# EAGLE design BusBlaster-v3.5 (EAGLE 5.07)
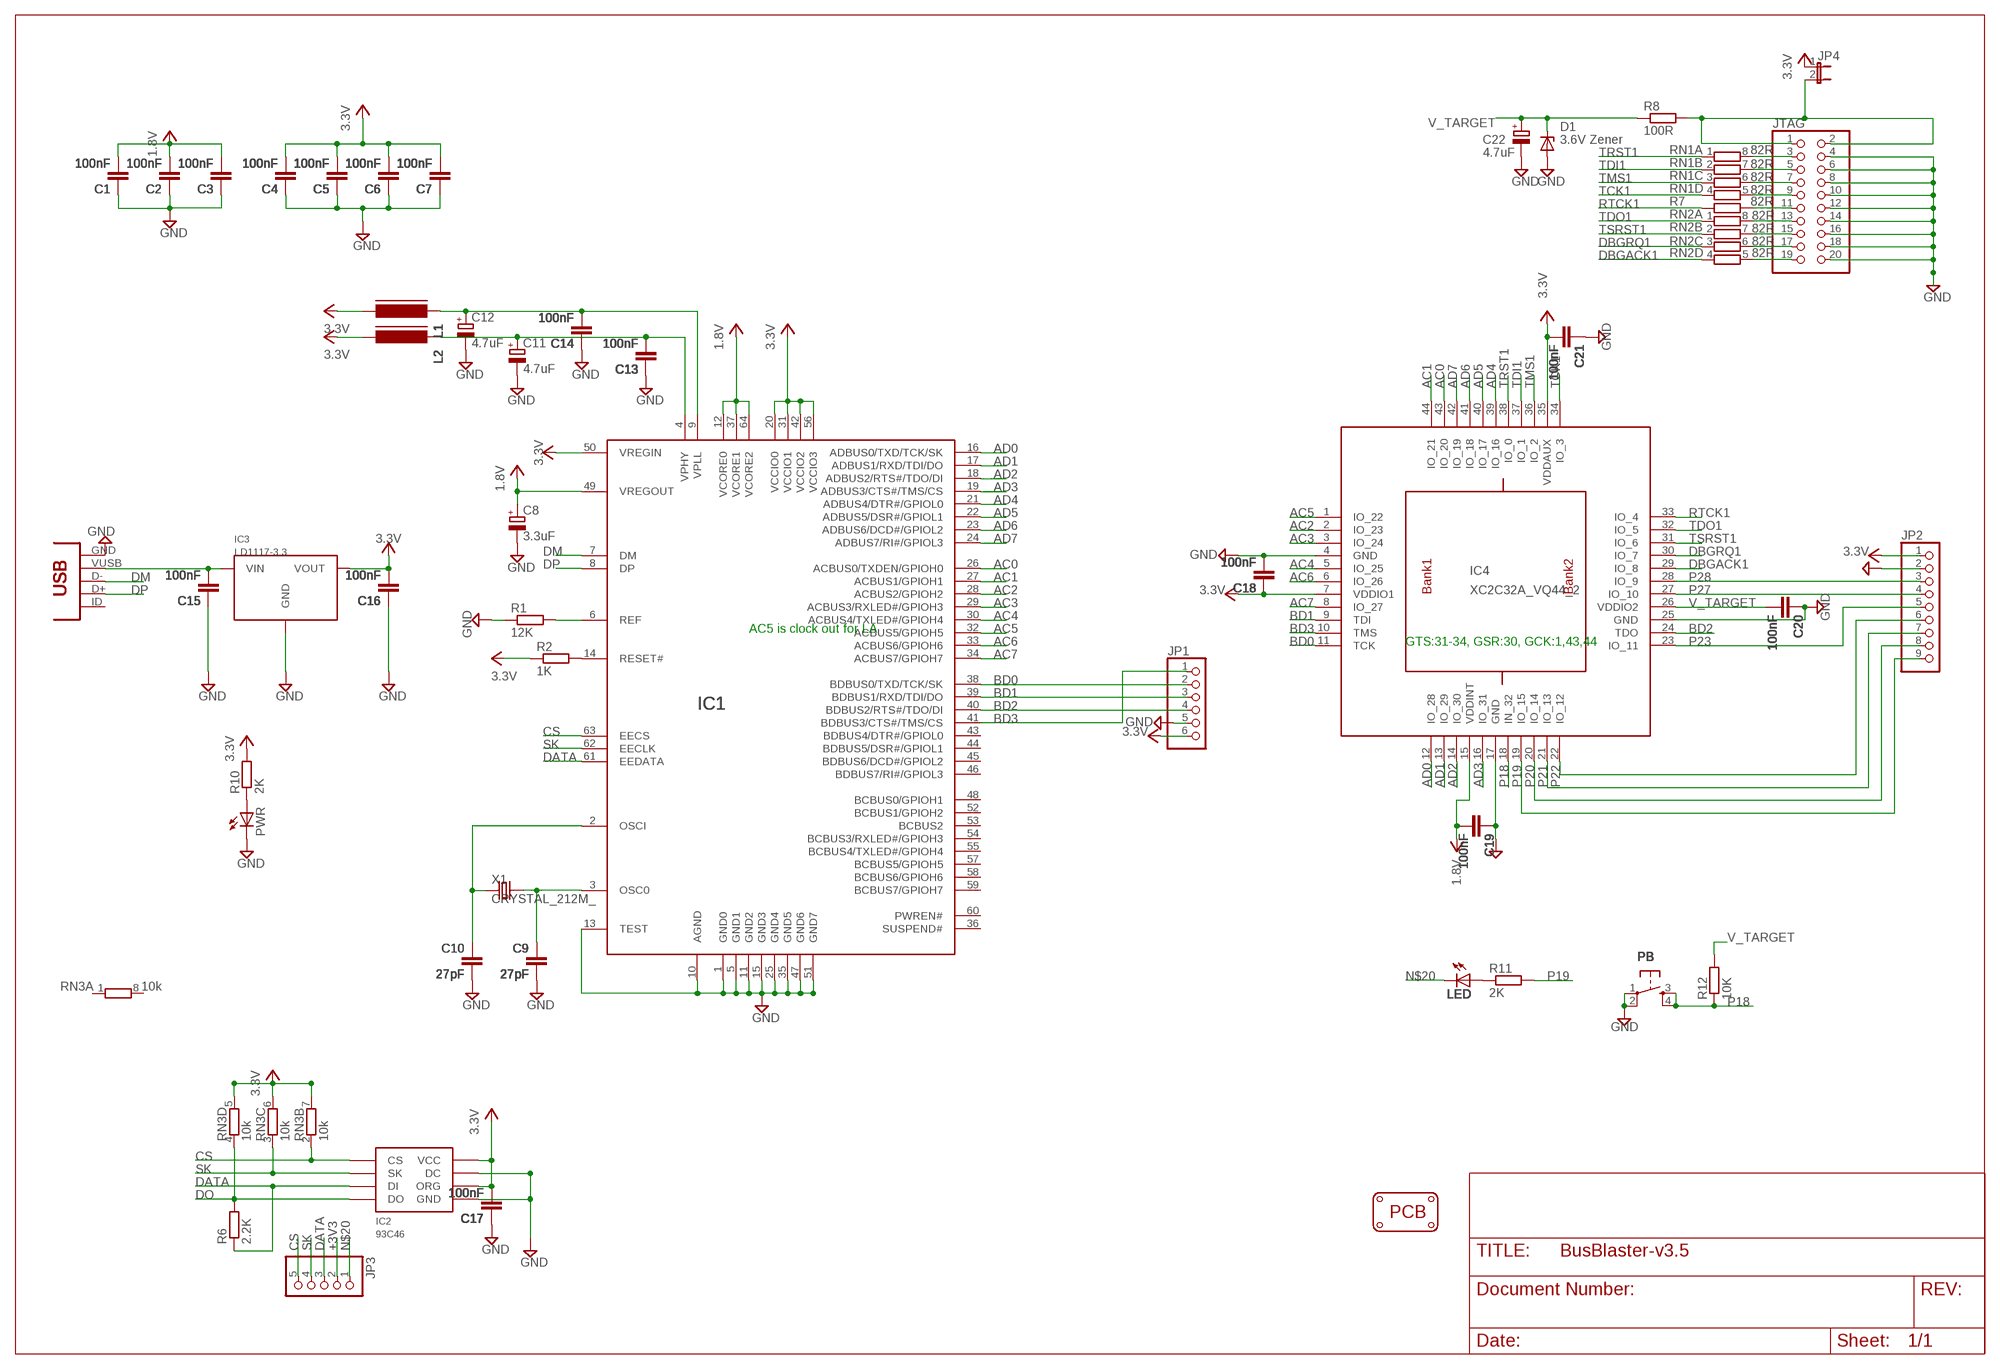
[diagram p0: schematic, sheet 1]

## Parts
C1  100nF  CAPC603  [C603]
C2  100nF  CAPC603  [C603]
C3  100nF  CAPC603  [C603]
C4  100nF  CAPC603  [C603]
C5  100nF  CAPC603  [C603]
C6  100nF  CAPC603  [C603]
C7  100nF  CAPC603  [C603]
C8  3.3uF  CAP_POLSMC_A  [SMC_A]
C9  27pF  CAPC603  [C603]
C10  27pF  CAPC603  [C603]
C11  4.7uF  CAP_POLSMC_A  [SMC_A]
C12  4.7uF  CAP_POLSMC_A  [SMC_A]
C13  100nF  CAPC603  [C603]
C14  100nF  CAPC603  [C603]
C15  100nF  CAPC603  [C603]
C16  100nF  CAPC603  [C603]
C17  100nF  CAPC603  [C603]
C18  100nF  CAPC603  [C603]
C19  100nF  CAPC603  [C603]
C20  100nF  CAPC603  [C603]
C21  100nF  CAPC603  [C603]
C22  4.7uF  CAP_POLSMC_A  [SMC_A]
D1  3.6V Zener  ZENERSOD-123  [SOD-123]
IC1  FT2232H  [LQFP64]
IC2  93C46  [SOIC8]
IC3  LD1117-3.3  [SOT223]
IC4  XC2C32A_VQ44_2  [VQ44]
JP1  PINHD-1X6  [1X06]
JP2  PINHD-1X9  [1X09]
JP3  PINHD-1X5  [1X05]
JP4  JP1EJP  [1X02]
JTAG  PINHEAD_-_COPY_PINHD-2X10SHROUDED  [PINHEAD_-_COPY_PINSHRD_PTH_2X10]
L1  FERRITE_BEAD603  [FB603]
L2  FERRITE_BEAD603  [FB603]
LED  LED805  [LED-805]
PB  SW-SMD-SMALL  [TACT_SWITCH_SMALL]
PCB3  PCB_DP_RECTANGLE-80X49  [DP8049_V1]
PWR  LEDCHIPLED_0805  [CHIPLED_0805]
R1  12K  RESISTORR603  [R603]
R2  1K  RESISTORR603  [R603]
R6  2.2K  RESISTORR603  [R603]
R7  82R  RESISTORR603  [R603]
R8  100R  RESISTORR1206  [R1206]
R10  2K  RESISTORR603  [R603]
R11  2K  RESISTORR603  [R603]
R12  10K  RESISTORR603  [R603]
RN1  82R  RNETWORK  [RN8P-4R-CRA06S]
RN2  82R  RNETWORK  [RN8P-4R-CRA06S]
RN3  10k  RNETWORK  [RN8P-4R-CRA06S]
USB  CON-USB-MINI-BUSB1  [CONN_USB_MINI-B]
X1  CRYSTAL_212M_  [4X6]

## Nets
1.8V: C1.2 C2.2 C3.2 C8.+ C19.2 IC1.12(VCORE0) IC1.37(VCORE1) IC1.49(VREGOUT) IC1.64(VCORE2) IC4.15(VDDINT)
+3V3: C4.2 C5.2 C6.2 C7.2 C16.2 C17.2 C18.1 C21.2 IC1.20(VCCIO0) IC1.31(VCCIO1) IC1.42(VCCIO2) IC1.50(VREGIN) IC1.56(VCCIO3) IC2.6(ORG) IC2.8(VCC) IC3.2(VOUT) IC4.7(VDDIO1) IC4.35(VDDAUX) JP1.6 JP2.1 JP3.2 JP4.1 L1.2 L2.2 R2.1 R10.2 RN3.5 RN3.6 RN3.7 ; supply symbol labelled 3.3V
AC0: IC1.26(ACBUS0/TXDEN/GPIOH0) IC4.43(IO_20)
AC1: IC1.27(ACBUS1/GPIOH1) IC4.44(IO_21)
AC2: IC1.28(ACBUS2/GPIOH2) IC4.2(IO_23)
AC3: IC1.29(ACBUS3/RXLED#/GPIOH3) IC4.3(IO_24)
AC4: IC1.30(ACBUS4/TXLED#/GPIOH4) IC4.5(IO_25)
AC5: IC1.32(ACBUS5/GPIOH5) IC4.1(IO_22)
AC6: IC1.33(ACBUS6/GPIOH6) IC4.6(IO_26)
AC7: IC1.34(ACBUS7/GPIOH7) IC4.8(IO_27)
AD0: IC1.16(ADBUS0/TXD/TCK/SK) IC4.12(IO_28)
AD1: IC1.17(ADBUS1/RXD/TDI/DO) IC4.13(IO_29)
AD2: IC1.18(ADBUS2/RTS#/TDO/DI) IC4.14(IO_30)
AD3: IC1.19(ADBUS3/CTS#/TMS/CS) IC4.16(IO_31)
AD4: IC1.21(ADBUS4/DTR#/GPIOL0) IC4.39(IO_16)
AD5: IC1.22(ADBUS5/DSR#/GPIOL1) IC4.40(IO_17)
AD6: IC1.23(ADBUS6/DCD#/GPIOL2) IC4.41(IO_18)
AD7: IC1.24(ADBUS7/RI#/GPIOL3) IC4.42(IO_19)
BD0: IC1.38(BDBUS0/TXD/TCK/SK) IC4.11(TCK) JP1.2
BD1: IC1.39(BDBUS1/RXD/TDI/DO) IC4.9(TDI) JP1.3
BD2: IC1.40(BDBUS2/RTS#/TDO/DI) IC4.24(TDO) JP1.4
BD3: IC1.41(BDBUS3/CTS#/TMS/CS) IC4.10(TMS) JP1.1
CS: IC1.63(EECS) IC2.1(CS) JP3.5 RN3.2
DATA: IC1.61(EEDATA) IC2.3(DI) JP3.3 R6.1
DBGACK1: IC4.29(IO_8) RN2.4
DBGRQ1: IC4.30(IO_7) RN2.3
DM: IC1.7(DM) USB.D-
DO: IC2.4(DO) R6.2 RN3.4
DP: IC1.8(DP) USB.D+
N$1: C9.1 IC1.3(OSC0) X1.2(X2)
N$2: C10.1 IC1.2(OSCI) X1.1(X1)
N$3: IC1.14(RESET#) R2.2
N$4: IC1.6(REF) R1.2
N$5: C15.2 IC3.3(VIN) USB.VUSB
N$6: PWR.A R10.1
N$7: JTAG.3 RN1.8
N$8: LED.A R11.1
N$9: JTAG.5 RN1.7
N$10: JTAG.7 RN1.6
N$11: JTAG.9 RN1.5
N$12: JTAG.11 R7.2
N$13: JTAG.13 RN2.8
N$14: JTAG.15 RN2.7
N$15: JTAG.17 RN2.6
N$16: JTAG.19 RN2.5
N$20: C1.1 C2.1 C3.1 C4.1 C5.1 C6.1 C7.1 C8.- C9.2 C10.2 C11.- C12.- C13.1 C14.1 C15.1 C16.1 C17.1 C18.2 C19.1 C20.1 C21.1 C22.- D1.A IC1.1(GND0) IC1.5(GND1) IC1.10(AGND) IC1.11(GND2) IC1.13(TEST) IC1.15(GND3) IC1.25(GND4) IC1.35(GND5) IC1.47(GND6) IC1.51(GND7) IC2.5(GND) IC2.7(DC) IC3.1(GND) IC4.4(GND) IC4.17(GND) IC4.25(GND) JP1.5 JP2.2 JP3.1 JTAG.4 JTAG.6 JTAG.8 JTAG.10 JTAG.12 JTAG.14 JTAG.16 JTAG.18 JTAG.20 LED.C PB.1 PB.2 PWR.C R1.1 USB.GND ; supply symbol labelled GND
P18: IC4.18(IN_32) PB.3 PB.4 R12.1
P19: IC4.19(IO_15) JP2.9 R11.2
P20: IC4.20(IO_14) JP2.8
P21: IC4.21(IO_13) JP2.7
P22: IC4.22(IO_12) JP2.6
P23: IC4.23(IO_11) JP2.5
P27: IC4.27(IO_10) JP2.4
P28: IC4.28(IO_9) JP2.3
RTCK1: IC4.33(IO_4) R7.1
SK: IC1.62(EECLK) IC2.2(SK) JP3.4 RN3.3
TCK1: IC4.34(IO_3) RN1.4
TDI1: IC4.37(IO_1) RN1.2
TDO1: IC4.32(IO_5) RN2.1
TMS1: IC4.36(IO_2) RN1.3
TRST1: IC4.38(IO_0) RN1.1
TSRST1: IC4.31(IO_6) RN2.2
V_TARGET: C20.2 C22.+ D1.C IC4.26(VDDIO2) R8.1 R12.2
V_TARGET_UNREG: JP4.2 JTAG.1 JTAG.2 R8.2
VPHY: C11.+ C13.2 IC1.4(VPHY) L2.1
VPLL: C12.+ C14.2 IC1.9(VPLL) L1.1
Unconnected: IC1.36(SUSPEND#) IC1.43(BDBUS4/DTR#/GPIOL0) IC1.44(BDBUS5/DSR#/GPIOL1) IC1.45(BDBUS6/DCD#/GPIOL2) IC1.46(BDBUS7/RI#/GPIOL3) IC1.48(BCBUS0/GPIOH1) IC1.52(BCBUS1/GPIOH2) IC1.53(BCBUS2) IC1.54(BCBUS3/RXLED#/GPIOH3) IC1.55(BCBUS4/TXLED#/GPIOH4) IC1.57(BCBUS5/GPIOH5) IC1.58(BCBUS6/GPIOH6) IC1.59(BCBUS7/GPIOH7) IC1.60(PWREN#) RN3.1 RN3.8 USB.BODY@1(BODY) USB.BODY@2(BODY) USB.BODY@3(BODY) USB.BODY@4(BODY) USB.ID(USBID)

## Notes on the sheet
- AC5 is clock out for LA
- GTS:31-34, GSR:30, GCK:1,43,44

## Library data of the parts
C1-C7 C9 C10 C13-C21 = dp_devices:CAP
C8 C11 C12 C22 = DP-EagleLibrary:CAP_POL
D1 = dp_devices:ZENER: Zener Diode SOD-323
IC1 = dp_devices:FT2232H: DUAL HIGH SPEED USB TO MULTIPURPOSE UART/FIFO IC
IC2 = DP-EagleLibrary:93C46
IC3 = DP-EagleLibrary:LD1117-3.3
IC4 = dp_devices:XC2C32A_VQ44_2: xc2c32a_vq44-ian edit this description Auto generated by make-symbol-device-package-bsdl.ulp Rev. 29 Source: xc2c32a_vq44-ian.bsd
JP1 = pinhead:PINHD-1X6: PIN HEADER
JP2 = pinhead - Copy:PINHD-1X9: PIN HEADER
JP3 = pinhead:PINHD-1X5: PIN HEADER
JP4 = jumper:JP1E: JUMPER
JTAG = LPC1768board:PINHEAD_-_COPY_PINHD-2X10: PIN HEADER
L1 L2 = dp_devices:FERRITE_BEAD
LED = dp_devices:LED
PB = dp_devices:SW-SMD-SMALL
PCB3 = dp_devices:PCB_DP_RECTANGLE: Dangerous Prototypes Standard Rectangular PCB sizes
PWR = led:LED: LED OSRAM: - CHIPLED LG R971, LG N971, LY N971, LG Q971, LY Q971, LO R971, LY R971 LH N974, LH R974 LS Q976, LO Q976, LY Q976 LO Q996 - Hyper CHIPLED LW Q18S LB Q993, LB Q99A, LB R99A - SideLED LS A670, LO A670, LY A670, LG A670, LP A670 LB A673, LV A673, LT A673, LW A673 LH A674 LY A675 LS A676, LA A676, LO A676, LY A676, LW A676 LS A679, LY A679, LG A679 - Hyper Micro SIDELED® LS Y876, LA Y876, LO Y876, LY Y876 LT Y87S - SmartLED LW L88C, LW L88S LB L89C, LB L89S, LG L890 LS L89K, LO L89K, LY L89K LS L896, LA L896, LO L896, LY L896 - TOPLED LS T670, LO T670, LY T670, LG T670, LP T670 LSG T670, LSP T670, LSY T670, LOP T670, LYG T670 LG T671, LOG T671, LSG T671 LB T673, LV T673, LT T673, LW T673 LH T674 LS T676, LA T676, LO T676, LY T676, LB T676, LH T676, LSB T676, LW T676 LB T67C, LV T67C, LT T67C, LS T67K, LO T67K, LY T67K, LW E67C LS E67B, LA E67B, LO E67B, LY E67B, LB E67C, LV E67C, LT E67C LW T67C LS T679, LY T679, LG T679 LS T770, LO T770, LY T770, LG T770, LP T770 LB T773, LV T773, LT T773, LW T773 LH T774 LS E675, LA E675, LY E675, LS T675 LS T776, LA T776, LO T776, LY T776, LB T776 LHGB T686 LT T68C, LB T68C - Hyper Mini TOPLED® LB M676 - Mini TOPLED Santana® LG M470 LS M47K, LO M47K, LY M47K Source: http://www.osram.convergy.de LUXEON: - LUMILED® LXK2-PW12-R00, LXK2-PW12-S00, LXK2-PW14-U00, LXK2-PW14-V00 LXK2-PM12-R00, LXK2-PM12-S00, LXK2-PM14-U00 LXK2-PE12-Q00, LXK2-PE12-R00, LXK2-PE12-S00, LXK2-PE14-T00, LXK2-PE14-U00 LXK2-PB12-K00, LXK2-PB12-L00, LXK2-PB12-M00, LXK2-PB14-N00, LXK2-PB14-P00, LXK2-PB14-Q00 LXK2-PR12-L00, LXK2-PR12-M00, LXK2-PR14-Q00, LXK2-PR14-R00 LXK2-PD12-Q00, LXK2-PD12-R00, LXK2-PD12-S00 LXK2-PH12-R00, LXK2-PH12-S00 LXK2-PL12-P00, LXK2-PL12-Q00, LXK2-PL12-R00 Source: www.luxeon.com KINGBRIGHT: KA-3528ASYC Source: www.kingbright.com
R1 R2 R6-R8 R10-R12 = dp_devices:RESISTOR
RN1-RN3 = dp_devices:RNETWORK: 4 Resistor Array 0603
USB = dp_devices:CON-USB-MINI-B: USB connector
X1 = dp_devices:CRYSTAL_2

## Board
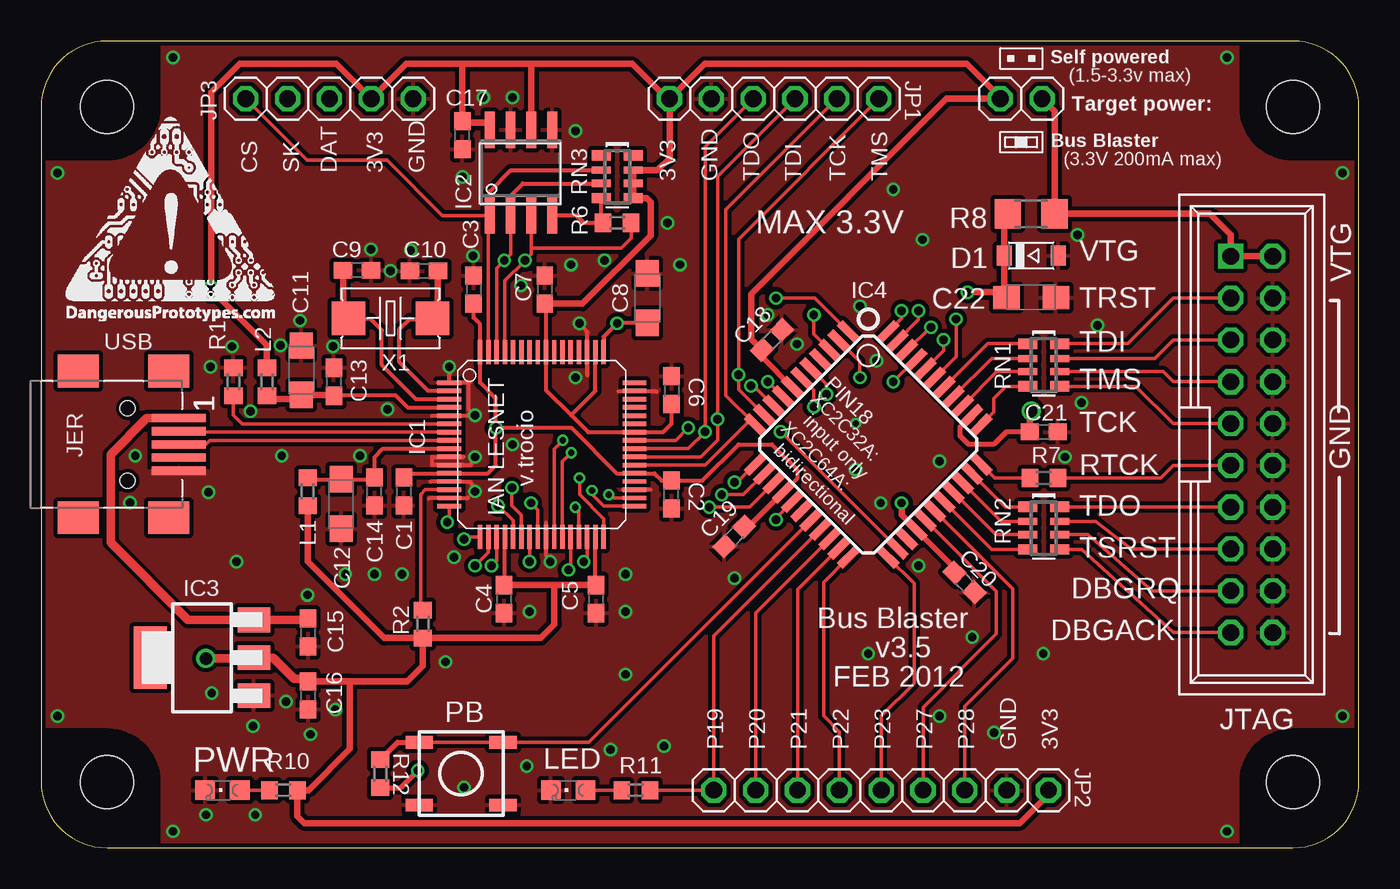
[diagram p1: board, top side]
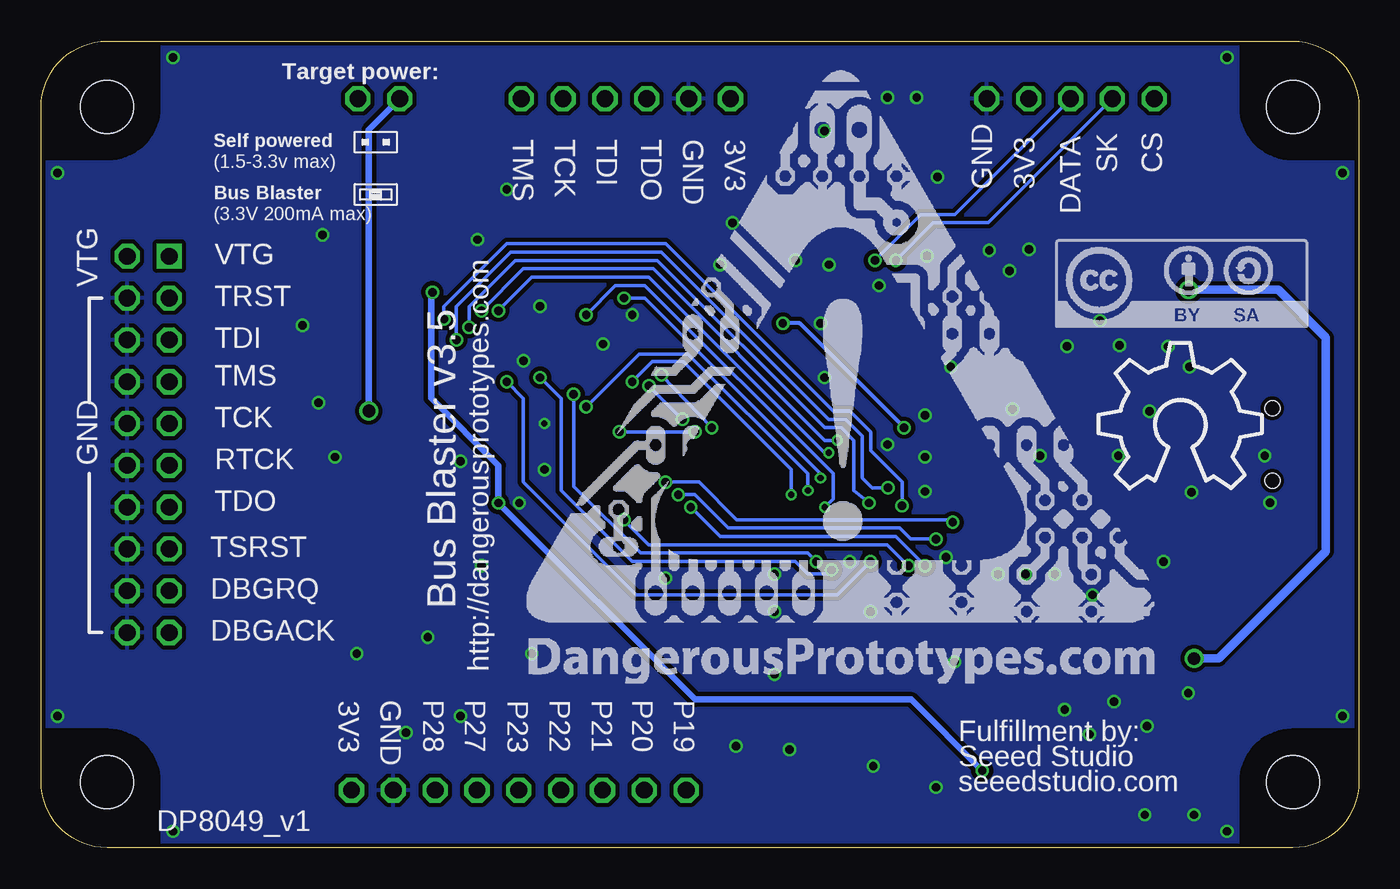
[diagram p2: board, bottom side, seen from below]

Size 80 x 49 mm. Coordinates in mm from the lower left corner, seen from the top.
Copper layers (1*16): Top 0.035mm / dielectric 1.5mm / Bottom 0.035mm
Design rules "Fusion_eagle_rule_v1.1": minimum track width 6mil, minimum drill 12mil, track to track 6mil, track to pad 6mil, pad to pad 6mil, via to via 6mil, smd to smd 0mil, copper to edge 10mil, drill to drill 10mil, minimum pad ring 10mil, minimum via ring 6mil, stop-mask expansion 2mil, vias tented up to drill 100mil, thermal gap 10mil

### Footprints (pad centres in the part's own frame; a part is rotated, then mirrored left to right if it is on the bottom)
C603 = smd 1.1 x 1: 1 -0.85,0; 2 0.85,0
SMC_A = smd 1.6 x 1.4: + -1.5,0; - 1.5,0
SOD-123 = smd 0.91 x 1.22: A 1.635,0; C -1.635,0
LQFP64 = smd 1.45 x 0.27: 1 -5.625,3.75; 2 -5.625,3.25; 3 -5.625,2.75; 4 -5.625,2.25; 5 -5.625,1.75; 6 -5.625,1.25; 7 -5.625,0.75; 8 -5.625,0.25; 9 -5.625,-0.25; 10 -5.625,-0.75; 11 -5.625,-1.25; 12 -5.625,-1.75; 13 -5.625,-2.25; 14 -5.625,-2.75; 15 -5.625,-3.25; 16 -5.625,-3.75; 33 5.625,-3.75; 34 5.625,-3.25; 35 5.625,-2.75; 36 5.625,-2.25; 37 5.625,-1.75; 38 5.625,-1.25; 39 5.625,-0.75; 40 5.625,-0.25; 41 5.625,0.25; 42 5.625,0.75; 43 5.625,1.25; 44 5.625,1.75; 45 5.625,2.25; 46 5.625,2.75; 47 5.625,3.25; 48 5.625,3.75 | smd 0.27 x 1.45: 17 -3.75,-5.625; 18 -3.25,-5.625; 19 -2.75,-5.625; 20 -2.25,-5.625; 21 -1.75,-5.625; 22 -1.25,-5.625; 23 -0.75,-5.625; 24 -0.25,-5.625; 25 0.25,-5.625; 26 0.75,-5.625; 27 1.25,-5.625; 28 1.75,-5.625; 29 2.25,-5.625; 30 2.75,-5.625; 31 3.25,-5.625; 32 3.75,-5.625; 49 3.75,5.625; 50 3.25,5.625; 51 2.75,5.625; 52 2.25,5.625; 53 1.75,5.625; 54 1.25,5.625; 55 0.75,5.625; 56 0.25,5.625; 57 -0.25,5.625; 58 -0.75,5.625; 59 -1.25,5.625; 60 -1.75,5.625; 61 -2.25,5.625; 62 -2.75,5.625; 63 -3.25,5.625; 64 -3.75,5.625
SOIC8 = smd 0.6 x 2.2: 1 -1.905,-2.6; 2 -0.635,-2.6; 3 0.635,-2.6; 4 1.905,-2.6; 5 1.905,2.6; 6 0.635,2.6; 7 -0.635,2.6; 8 -1.905,2.6
SOT223 = smd 1.5 x 2: 1 -2.3,-3.15; 2 0,-3.15; 3 2.3,-3.15 | smd 3.8 x 2: 4 0,3.15
VQ44 = smd 1.5 x 0.5: 1 -5.7,4; 2 -5.7,3.2; 3 -5.7,2.4; 4 -5.7,1.6; 5 -5.7,0.8; 6 -5.7,0; 7 -5.7,-0.8; 8 -5.7,-1.6; 9 -5.7,-2.4; 10 -5.7,-3.2; 11 -5.7,-4; 23 5.7,-4; 24 5.7,-3.2; 25 5.7,-2.4; 26 5.7,-1.6; 27 5.7,-0.8; 28 5.7,0; 29 5.7,0.8; 30 5.7,1.6; 31 5.7,2.4; 32 5.7,3.2; 33 5.7,4 | smd 0.5 x 1.5: 12 -4,-5.7; 13 -3.2,-5.7; 14 -2.4,-5.7; 15 -1.6,-5.7; 16 -0.8,-5.7; 17 0,-5.7; 18 0.8,-5.7; 19 1.6,-5.7; 20 2.4,-5.7; 21 3.2,-5.7; 22 4,-5.7; 34 4,5.7; 35 3.2,5.7; 36 2.4,5.7; 37 1.6,5.7; 38 0.8,5.7; 39 0,5.7; 40 -0.8,5.7; 41 -1.6,5.7; 42 -2.4,5.7; 43 -3.2,5.7; 44 -4,5.7
1X06 = drill 1.016 octagon: 1 -6.35,0; 2 -3.81,0; 3 -1.27,0; 4 1.27,0; 5 3.81,0; 6 6.35,0
1X09 = drill 1.016 octagon: 1 -10.16,0; 2 -7.62,0; 3 -5.08,0; 4 -2.54,0; 5 0,0; 6 2.54,0; 7 5.08,0; 8 7.62,0; 9 10.16,0
1X05 = drill 1.016 octagon: 1 -5.08,0; 2 -2.54,0; 3 0,0; 4 2.54,0; 5 5.08,0
1X02 = drill 1.016 octagon: 1 -1.27,0; 2 1.27,0
PINHEAD_-_COPY_PINSHRD_PTH_2X10 = drill 1.016 square: 1 -11.43,-1.27 | drill 1.016 octagon: 2 -11.43,1.27; 3 -8.89,-1.27; 4 -8.89,1.27; 5 -6.35,-1.27; 6 -6.35,1.27; 7 -3.81,-1.27; 8 -3.81,1.27; 9 -1.27,-1.27; 10 -1.27,1.27; 11 1.27,-1.27; 12 1.27,1.27; 13 3.81,-1.27; 14 3.81,1.27; 15 6.35,-1.27; 16 6.35,1.27; 17 8.89,-1.27; 18 8.89,1.27; 19 11.43,-1.27; 20 11.43,1.27
FB603 = smd 1 x 1.1: 1 -0.85,0; 2 0.85,0
LED-805 = smd 1.2 x 1.2: A 0,-1.05; C 0,1.05
TACT_SWITCH_SMALL = smd 1.651 x 0.762: 1 -2.54,1.905; 2 2.54,1.905; 3 -2.54,-1.905; 4 2.54,-1.905
DP8049_V1 = hole 3.2: 4,4; 76,4; 76,45; 4,45
CHIPLED_0805 = smd 1.2 x 1.2: A 0,-1.05; C 0,1.05
R603 = smd 1 x 1.1: 1 -0.85,0; 2 0.85,0
R1206 = smd 1.6 x 1.803: 1 -1.422,0; 2 1.422,0
RN8P-4R-CRA06S = smd 0.63 x 1.15: 1 -1.295,-0.975; 4 1.295,-0.975; 5 1.295,0.975; 8 -1.295,0.975 | smd 0.44 x 1.15: 2 -0.4,-0.975; 3 0.4,-0.975; 6 0.4,0.975; 7 -0.4,0.975
CONN_USB_MINI-B = smd 2 x 2.5: BODY@1 -4.45,2.5; BODY@2 4.45,2.5; BODY@3 4.45,-3; BODY@4 -4.45,-3 | smd 0.5 x 3.3: D+ 0,3.1; D- -0.8,3.1; GND 1.6,3.1; ID 0.8,3.1; VUSB -1.6,3.1 | hole 0.9: -2.2,0; 2.2,0
4X6@1 = smd 2.032 x 2.032: 1 -2.54,0; 2 2.54,0

### Placement (x,y rotation side)
C1  22.02,21.64 90 top
C2  38.27,21.46 90 top
C3  26.26,33.9 270 top
C4  28.11,15.1 90 top
C5  33.7,15.1 90 top
C6  38.27,27.8 270 top
C7  30.57,33.9 270 top
C8  36.8,33.39 90 top
C9  19.18,35.09 0 top
C10  23.24,35.04 180 top
C11  15.8,29.01 90 top
C12  18.21,20.88 270 top
C13  17.77,28.31 270 top
C14  20.24,21.64 90 top
C15  16.21,13.07 90 top
C16  16.21,9.26 90 top
C17  25.57,43.3 90 top
C18  44.37,30.85 45 top
C19  42.08,18.91 45 top
C20  56.05,16.12 135 top
C21  60.87,25.26 180 top
C22  60.11,33.43 0 top
D1  60.11,35.97 0 top
IC1  30.4,24.5 0 top
IC2  29.13,41.01 0 top
IC3  9.77,11.55 90 top
IC4  50.21,24.5 315 top
JP1  44.5,45.5 180 top
JP2  51,3.5 180 top
JP3  17.5,45.5 180 top
JP4  59.5,45.5 0 top
JTAG  73.5,24.5 270 top
L1  16.18,21.64 270 top
L2  13.71,28.31 90 top
LED  32,3.5 90 top
PB  25.5,4.5 180 top
PCB3  0,0 0 top
PWR  11,3.5 90 top
R1  11.68,28.31 270 top
R2  23.18,13.6 90 top
R6  34.97,37.96 180 top
R7  60.87,22.47 0 top
R8  60.11,38.51 0 top
R10  14.7,3.5 0 top
R11  36.1,3.5 0 top
R12  20.59,4.5 270 top
RN1  60.87,29.33 270 top
RN2  60.87,19.42 270 top
RN3  34.97,40.76 270 top
U$1  [DP_LOGO_ART_1.5X1.5]  50.5,10 0 bottom
U$2  [DP_LOGO_ART_0.5X0.5]  1.5,32 0 top
U$3  [CC-BY-SA]  18.42,31.63 0 bottom
U$5  [OSHW_10X350_NOTEXT]  15.8,21.82 0 bottom
U$6  adasdsd  [JUMP2_DESC_ON]  59.69,39.69 0 bottom
U$7  [JUMP2_DESC_OFF]  59.69,42.86 0 bottom
U$8  [JUMP2_DESC_OFF]  59.5,47.94 0 top
U$9  adasdsd  [JUMP2_DESC_ON]  59.5,42.86 0 top
USB  5.25,24.5 270 top
X1  CRYSTAL_212M_  [4X6@1]  21.21,32.17 180 top

### Tracks (layer width: path | path; a pad name or v marks a point on that pad's centre or on a via)
1.8V  (via drill 0.51)
  Top 0.254: C1.2 22.08,22.43 21.91,22.54 22.11,22.75 IC1.12 27.13,22.75 27.61,23.23 v27.61,25.52 | C3.2 26.26,32.2 26.65,31.81 IC1.64 26.65,28.25 27.61,27.29 v27.61,25.52 | v27.61,25.52 32.18,25.52 34.94,22.75 IC1.37 37.23,22.75 37.67,22.31 C2.2 40.14,22.31 42.34,24.5 44.37,24.5 45.89,22.98 45.89,22.45 IC4.15 | C8.+ 35,31.89 v34.97,31.87 34.15,31.04 IC1.49
  Top 0.305: IC4.15 42.96,19.51 C19.2
  Bottom 0.254: v34.97,31.87 33.96,31.87 v27.61,25.52
+3V3  (via drill 0.76)
  Top 0.254: IC1.20 28.15,15.99 C4.2 | C7.2 30.65,32.97 IC1.56 30.65,27.81 32.18,26.28 | IC1.31 33.65,16 C5.2 | C6.2 38.27,25.76 37.77,25.25 IC1.42 33.21,25.25 32.18,26.28 | IC1.50 33.65,27.75 32.18,26.28
  Top 0.305: 43.77,30.43 C18.1 43.77,29.81 IC4.7 | C21.2 58.59,25.26 57.83,24.5 56.31,24.5 55.8,25.01 55.8,25.56 IC4.35
  Top 0.406: IC2.8 27.23,43.93 27.1,44.06 25.66,44.06 C17.2 25.57,47.62 | C7.2 32.85,33.05 37,37.2 37,39.23 36.77,39.46 RN3.5 RN3.6 RN3.7 37.4,41.16 38.15,41.9 JP1.6 | L1.2 16.18,17.39 20.82,12.75 R2.1 | 31.16,15.95 C4.2 | 31.16,15.95 C5.2 | C18.1 43.1,30.92 43.1,33.64 54.96,45.5 JP4.1 58.23,45.59 56.2,47.62 40.27,47.62 JP1.6 | 31.16,15.95 31.16,13.58 30.33,12.75 R2.1 | v60.11,26.53 60.02,26.44 C21.2 | 16.12,10.12 16.14,10.11 18.75,10.11 | 18.75,10.11 18.75,6 16.24,3.49 R10.2 | 18.75,10.11 22.24,10.11 23.18,11.05 R2.1 | L2.2 13.71,30.52 v10.33,33.9 10.33,45.89 12.06,47.62 17.91,47.62 JP3.2 22.16,47.62 25.57,47.62 | JP1.6 38,45.5 35.88,47.62 29.77,47.62 | 25.57,47.62 29.77,47.62 | 29.77,47.62 IC2.6 | JP2.1 61.16,3.24 59.42,1.5 15.96,1.5 15.56,1.91 R10.2 | R10.2
  Top 0.508: 16.07,10.25 15.38,10.25 14.08,11.55 IC3.2 12.87,11.5 v10,11.5 | 16.07,10.25 C16.2 | 16.07,10.25 16.07,10.18 16.12,10.12
  Bottom 0.406: v60.11,26.53 60.11,43.62 JP4.1
  Bottom 0.508: v10.33,33.9 4.9,33.9 2,31 2,18 8.5,11.5 v10,11.5
AC0  (via drill 0.38, 0.51)
  Top 0.203: IC1.26 31.15,24.23 v31.67,24.75 | v53.26,32.63 53.26,32.07 IC4.43
  Bottom 0.203: v31.67,24.75 32.43,24.75 42.85,35.17 50.72,35.17 v53.26,32.63
AC1  (via drill 0.38, 0.51)
  Top 0.203: IC1.27 31.65,23.46 v32.18,23.99 | v52.24,32.63 52.24,32.19 IC4.44
  Bottom 0.203: v32.18,23.99 32.43,23.99 43.1,34.66 50.21,34.66 v52.24,32.63
AC2  (via drill 0.51)
  Top 0.203: v49.7,28.56 49.7,29.53 IC4.2 | IC1.28 32.15,17.01 v32.02,16.88
  Bottom 0.203: v49.7,28.56 48.43,27.29 48.43,21.71 44.12,17.39 34.21,17.39 33.45,16.63 32.27,16.63 v32.02,16.88
AC3  (via drill 0.38, 0.51)
  Top 0.203: IC1.29 32.65,20.47 v32.43,20.69 | v46.91,32.37 46.91,31.2 IC4.3
  Bottom 0.203: v32.43,20.69 31.92,21.2 31.92,22.72 43.35,34.15 45.13,34.15 v46.91,32.37
AC4  (via drill 0.51)
  Top 0.203: IC1.30 33.15,17.6 v32.94,17.39 | v47.67,27.55 47.67,28.17 IC4.5
  Bottom 0.203: v32.94,17.39 33.45,17.9 43.61,17.9 47.67,21.96 v47.67,27.55
AC5  (via drill 0.38, 0.51)
  Top 0.203: IC1.32 34.15,19.99 32.69,21.45 v32.69,22.47 | IC4.1 46.98,33.39 v44.62,33.39
  Bottom 0.203: v32.69,22.47 32.69,22.72 43.35,33.39 v44.62,33.39
AC6  (via drill 0.38, 0.51)
  Top 0.203: IC1.33 34.15,20.75 33.45,21.45 v33.45,21.71 | v46.91,26.79 46.91,27.8 IC4.6
  Bottom 0.203: v33.45,21.71 33.45,22.72 40.73,30 43.69,30 v46.91,26.79
AC7  (via drill 0.38, 0.51)
  Top 0.203: IC1.34 34.77,21.25 v34.46,21.45 | v44.12,28.31 45.03,27.4 IC4.8
  Bottom 0.203: v34.46,21.45 34.46,22.98 41.02,29.53 42.9,29.53 v44.12,28.31
AD0  (via drill 0.51)
  Top 0.203: v42.08,22.21 42.27,22.21 IC4.12 | IC1.16 24.77,19.89 v24.65,19.77
  Bottom 0.203: v42.08,22.21 40.05,22.21 37.77,19.93 24.81,19.93 v24.65,19.77
AD1  (via drill 0.51)
  Top 0.203: v41.32,21.45 42.64,21.45 IC4.13 | IC1.17 25.86,18.88 v25.67,18.75
  Bottom 0.203: v41.32,21.45 40.31,21.45 38.27,19.42 27.86,19.42 27.19,18.75 v25.67,18.75
AD2  (via drill 0.51)
  Top 0.203: v40.56,20.69 43.01,20.69 IC4.14 | IC1.18 27.15,17.95 v26.34,17.13
  Bottom 0.203: v26.34,17.13 28.11,18.91 38.78,18.91 v40.56,20.69
AD3  (via drill 0.51)
  Top 0.203: IC1.19 27.65,17.43 v27.35,17.13 | v44.62,19.93 44.51,19.93 IC4.16
  Bottom 0.203: v27.35,17.13 28.62,18.4 43.1,18.4 v44.62,19.93
AD4  (via drill 0.51)
  Top 0.203: v55.55,32.12 55.55,29.83 IC4.39 | IC1.21 28.65,19.87 v27.73,20.79
  Bottom 0.203: v55.55,32.12 55.55,32.88 51.74,36.69 42.08,36.69 31.92,26.53 30.91,26.53 29.64,25.26 29.64,24.13 27.73,22.23 v27.73,20.79
AD5  (via drill 0.51)
  Top 0.203: v54.78,30.85 54.78,30.2 IC4.40 | IC1.22 29.15,20.22 28.57,20.8 28.57,21.85 v28.59,21.86
  Bottom 0.203: v54.78,30.85 54.78,32.88 51.48,36.18 42.34,36.18 32.18,26.02 31.16,26.02 30.15,25.01 30.15,22.47 29.54,21.86 v28.59,21.86
AD6  (via drill 0.51)
  Top 0.203: IC1.23 v29.65,17.4 v29.64,17.39 | v51.74,28.31 53.09,29.66 IC4.41
  Bottom 0.203: v29.64,17.39 31.67,15.36 43.86,15.36 50.72,22.21 50.72,27.29 v51.74,28.31
AD7  (via drill 0.51)
  Top 0.203: 54.02,31.7 v54.02,31.61 IC4.42 | IC1.24 30.15,20.53 v29.73,20.94
  Bottom 0.203: v54.02,31.61 54.02,32.88 51.23,35.68 42.59,35.68 32.43,25.52 31.42,25.52 30.65,24.75 30.65,21.71 v29.73,20.94
BD0
  Top 0.203: IC1.38 40.33,23.25 42.97,25.9 | 42.97,25.9 43.1,26.02 | 42.97,25.9 43.17,25.7 IC4.11 41.58,27.48 41.58,38.77 JP1.2
BD1  (via drill 0.51)
  Top 0.203: IC1.39 40.05,23.75 41.07,24.77 v41.07,26.02 41.07,40.8 JP1.3 | IC4.9 43.26,28.06 v43.1,28.06
  Bottom 0.203: v41.07,26.02 v43.1,28.06
BD2  (via drill 0.51)
  Top 0.203: IC1.40 39.29,24.25 v40.31,25.27 | IC4.24 44.92,25.26 v44.88,25.26 | v40.31,25.27 v40.31,25.26 | v40.31,25.27 40.31,42.58 JP1.4
  Bottom 0.203: v40.31,25.26 v44.88,25.26
BD3  (via drill 0.51)
  Top 0.203: IC1.41 38.52,24.75 v39.29,25.52 | IC4.10 42.34,27.85 v42.34,28.72 42.34,36.99 JP1.1
  Bottom 0.203: 39.24,25.52 v39.29,25.52 v42.34,28.72
CS
  Top 0.203: IC1.63 27.15,38.34 IC2.1 24.36,38.41 21,41.77 16.15,41.77 JP3.5
  Top 0.254: RN3.2 28.51,41.16 27.23,39.87 IC2.1
DATA  (via drill 0.51)
  Top 0.203: IC1.61 28.15,34.44 v29.38,35.68 29.77,36.06 29.77,36.44 | 29.77,36.44 IC2.3 | R6.1 35.82,37.03 35.23,36.44 29.77,36.44
  Bottom 0.203: v29.38,35.68 26.59,38.47 24.53,38.47 JP3.3
DBGACK1
  Top 0.203: IC4.29 57.72,18.12 RN2.4
DBGRQ1
  Top 0.203: IC4.30 57.95,19.02 RN2.3
DM
  Top 0.203: IC1.7 8.23,25.25 USB.D-
DO
  Top 0.254: RN3.4 34,38.09 R6.2 32.94,37.96 32.49,38.41 IC2.4
DP
  Top 0.203: IC1.8 10.23,24.75 9.98,24.5 USB.D+
N$1
  Top 0.254: IC1.3 22.75,27.25 20.69,29.31 20.69,31.44 20,32.12 19.21,32.12 X1.2
  Top 0.406: C9.1 18.33,32.51 X1.2
N$2
  Top 0.254: IC1.2 23.5,27.75 21.75,29.5 21.75,31.5 22.38,32.12 24.2,32.12 X1.1
  Top 0.406: C10.1 24.09,32.51 X1.1
N$3
  Top 0.203: IC1.14 23.33,21.75 23.03,21.45 23.03,14.59 R2.2
N$4
  Top 0.203: IC1.6 12.2,25.75 11.68,26.28 R1.2
N$5
  Top 0.508: USB.VUSB 6.42,26.1 4.21,23.89 4.21,18.54 8.9,13.85 IC3.3 16.13,13.85 C15.2
N$6
  Top 0.203: PWR.A R10.1
N$7
  Top 0.203: RN1.8 65.96,30.62 68.73,33.39 JTAG.3
N$8
  Top 0.203: LED.A R11.1
N$9
  Top 0.203: RN1.7 67.61,29.73 68.73,30.85 JTAG.5
N$10
  Top 0.203: RN1.6 68.11,28.93 68.73,28.31 JTAG.7
N$11
  Top 0.203: RN1.5 66.47,28.03 68.73,25.77 JTAG.9
N$12
  Top 0.203: R7.2 67.97,22.47 68.73,23.23 JTAG.11
N$13
  Top 0.203: RN2.8 61.87,20.69 JTAG.13
N$14
  Top 0.203: RN2.7 64.02,19.82 66.19,18.15 JTAG.15
N$15
  Top 0.203: JTAG.17 67.46,15.61 63.55,19.02 RN2.6
N$16
  Top 0.203: RN2.5 63.17,18.12 68.73,13.07 JTAG.19
N$20  (via drill 0.38, 0.51)
  Top 0.203: 30.65,17.84 30.66,17.84 | 23.8,21.25 23.6,21.25 23.54,21.2 | 30.7,17.75 30.7,17.43 v30.91,17.39
  Top 0.254: 30.65,19.42 30.65,17.84 30.65,17.8 30.7,17.75 | 30.65,19.42 30.65,19.76 | IC1.15 23.8,21.25 | 25.32,22.24 23.65,22.24 | 25.66,23.24 23.74,23.24 23.73,23.25 23.73,23.75 25.65,23.75 | 23.72,26.24 25.64,26.24 25.63,26.25 | 35.05,27.74 36.03,27.74 | 35.32,21.75 36.98,21.75 | 24.1,28.25 26.02,28.25 | IC1.5 25.63,26.25 | 24.81,28.79 24.77,28.75 IC1.1 25.95,28.25 25.96,28.25 25.96,26.63 26.12,26.47 25.9,26.25 25.63,26.25 | IC1.51 33.15,29.22 33.16,28.71 33.16,31.32 v32.69,31.87 | 36.03,27.74 IC1.47 | 36.03,27.74 37.33,27.74 37.37,27.7 | IC1.11 25.64,23.25 25.66,23.24 | IC1.13 25.31,22.25 25.32,22.24 | IC1.15 | 25.66,23.24 25.9,23.24 | 25.9,23.24 25.91,23.23 | IC1.15 25.89,21.25 25.9,21.27 | IC1.25 30.65,19.42 | 36.98,21.75 IC1.35 | 36.98,21.75 | 25.32,22.24 26.05,22.24 v26.34,21.64 | 25.9,23.24 26.09,23.24 v26.34,23.74
  other vias: 79,8 26.84,45.58 28.62,45.58 32.43,28.56 32.18,35.42 29.13,34.15 26.34,26.28 28.62,24.5 21.21,35.05 20.03,36.36 26.21,35.95 19.37,23.81 14.61,23.81 10.16,21.59 5.71,23.81 5.4,20.95 21.91,16.63 18.46,16.63 11.86,17.39 16.18,15.36 20.25,16.63 10,2 13,2 37.8,6.17 25.67,3.67 29.48,4.96 34.57,5.96 53.26,17.13 60.84,11.8 57.84,6.99 63.16,27.04 62.16,23.74 50.21,11.8 56.53,12.8 54.53,7.99 45.89,30.6 51.74,39.99 53.51,36.95 38.02,37.96 32.43,43.55 25.57,40.76 44.12,32.37 35.48,14.34 35.48,16.63 42.08,16.37 35.48,10.53 24.56,11.29 29.64,14.34 25.07,17.64 38.78,35.42 34.21,35.68 62.92,37.22 64.14,31.74 50.72,29.58 49.45,22.98 49.45,25.77 54.53,23.48 50.97,20.94 49.7,32.88 22.44,36.29 12.86,7.39 10.36,9.39 14.86,8.89 16.36,6.89 17.86,8.39 24.77,29.22 17.71,30.47 14.52,30.53 15.71,32.03 10.27,29.22 11.59,30.45 21.03,26.64 12.71,26.51 79,41 72,48 1,41 8,48 1,8 8,1 72,1
  pour Bottom (isolate 0.254): 0,0 80,0 80,49 0,49
  pour Top (isolate 0.254): 0,0 80,0 80,49 0,49
  pour Top (no thermals): 6.35,22.86 10.48,22.86 10.48,22.54 10.16,22.23 6.67,22.23 6.35,22.54
  pour Top (no thermals): 23.81,23.81 26.04,23.81 26.04,23.18 23.81,23.18
P18
  Top 0.203: PB.4 PB.3 33.25,6.41 IC4.18
  Top 0.305: PB.4 21.64,6.41 R12.1
P19
  Top 0.203: R11.2 JP2.9 40.84,12.87 IC4.19
P20
  Top 0.203: JP2.8 43.38,14.27 IC4.20
P21
  Top 0.203: JP2.7 45.92,15.68 IC4.21
P22
  Top 0.203: IC4.22 47.5,16.13 47.5,8 48.46,7.04 JP2.6
P23
  Top 0.203: IC4.23 53,16.05 53,10 51,8 JP2.5
P27
  Top 0.203: IC4.27 58,15.58 58,13 53.54,8.54 JP2.4
P28
  Top 0.203: IC4.28 59,15.71 59,11.5 56.08,8.58 JP2.3
RTCK1
  Top 0.203: IC4.33 57.9,22.47 R7.1
SK  (via drill 0.51)
  Top 0.203: IC1.62 27.65,35.21 v28.11,35.68 28.5,36.06 IC2.2
  Top 0.254: RN3.3 29.24,40.36 28.5,39.61 IC2.2
  Bottom 0.203: v28.11,35.68 25.83,37.96 22.5,37.96 JP3.4
TCK1
  Top 0.203: RN1.4 58.57,28.03 57.83,27.29 57.83,26.46 IC4.34
TDI1
  Top 0.203: RN1.2 57.7,29.73 IC4.37
TDO1
  Top 0.203: IC4.32 58.52,20.71 RN2.1
TMS1
  Top 0.203: RN1.3 58.03,28.93 IC4.36
TRST1
  Top 0.203: RN1.1 57.46,30.62 IC4.38
TSRST1
  Top 0.203: IC4.31 58.29,19.82 RN2.2
V_TARGET  (via drill 0.51)
  Top 0.305: IC4.26 55.38,17.06 C20.2 | R12.2 21.82,3.65 v22.86,4.69
  Top 0.406: R8.1 58.48,38.8 D1.C 58.48,33.94 58.29,33.75 | v52.24,20.94 52.24,20.2 IC4.26 | 58.29,33.75 C22.+ | v56.25,33.75 58.29,33.75
  Bottom 0.406: v56.25,33.75 56.32,33.68 56.32,27.31 52.24,23.23 v52.24,20.94 40.3,9 27.17,9 v22.86,4.69
V_TARGET_UNREG
  Top 0.406: JTAG.2 JTAG.1 72.23,37.24 70.96,38.51 R8.2 | R8.2 61.38,38.66 | R8.2 61.27,38.77 | R8.2 61.53,44.74 JP4.2
VPHY
  Top 0.254: IC1.4 22.25,26.75 21.5,27.5 17.81,27.5 C13.2
  Top 0.406: L2.1 13.9,27.27 15.54,27.27 C11.+ 17.72,27.51 C13.2
VPLL
  Top 0.254: IC1.9 20.75,24.25 20.24,23.74 C14.2 20.13,22.38 C12.+ 16.29,22.38 L1.1

### Text on the board
tNames: Self powered | (1.5-3.3v max) | Target power: | Bus Blaster | CS | SK | DAT | 3V3 | GND | 3V3 | GND | TDO | TDI | TCK | TMS | (3.3V 200mA max) | MAX 3.3V | VTG | VTG | TRST | TDI | TMS | TCK | JER | RTCK | GND | v.trocio | IAN LESNET | TDO | TSRST | DBGRQ | Bus Blaster | DBGACK | v3.5 | FEB 2012 | P19 | P20 | P21 | P22 | P23 | P27 | P28 | GND | 3V3
bNames: Target power: | 3V3 | GND | TDO | TDI | TCK | TMS | Self powered | CS | SK | (1.5-3.3v max) | 3V3 | GND | Bus Blaster | DATA | (3.3V 200mA max) | VTG | VTG | TRST | TDI | TMS | TCK | RTCK | GND | TDO | TSRST | Bus Blaster v3.5 | DBGRQ | DBGACK | http://dangerousprototypes.com | P19 | P20 | P21 | P22 | P23 | P27 | P28 | GND | 3V3 | Fulfillment by: | Seeed Studio | seeedstudio.com